# Altium schematic sheet SPI_breaktout_to_HDMI.SchDoc
size A4
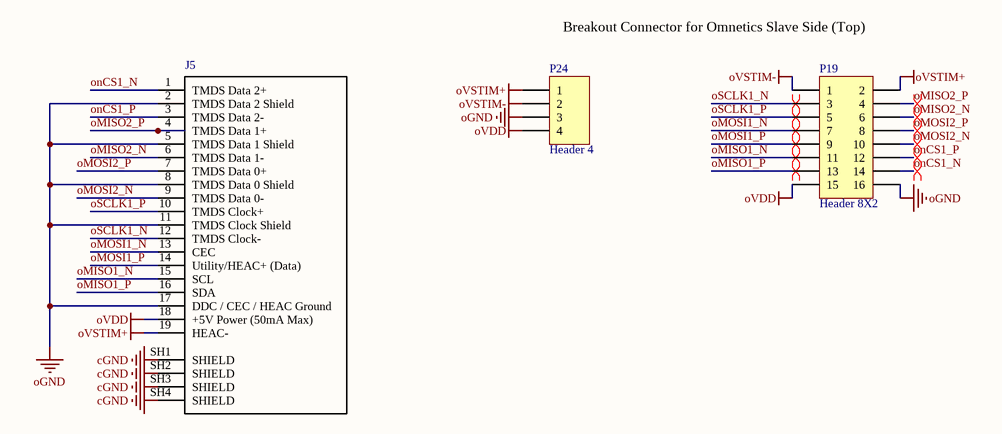
[diagram p0: SPI_breaktout_to_HDMI.SchDoc]

## Parts
J5  1747981-2  [TE_1747981-2_1747981-2(Primary)]  (value not drawn)
P19  Header 8X2  [TE_534998-8]
P24  Header 4  [OSTVN04A150]

## Nets
cGND: J5.SH1(SHIELD) J5.SH2(SHIELD) J5.SH3(SHIELD) J5.SH4(SHIELD)
oGND: J5.2(TMDS_Data_2_Shield) J5.5(TMDS_Data_1_Shield) J5.8(TMDS_Data_0_Shield) J5.11(TMDS_Clock_Shield) J5.17(DDC_/_CEC_/_HEAC_Ground) P19.16 P24.3
oVDD: J5.18(+5V_Power_(50mA_Max)) P19.15 P24.4
oVSTIM+: J5.19(HEAC-) P19.2 P24.1
oVSTIM-: P19.1 P24.2
oMISO1_N: J5.15(SCL) P19.11
oMISO1_P: J5.16(SDA) P19.13
oMISO2_N: J5.6(TMDS_Data_1-) P19.6
oMISO2_P: J5.4(TMDS_Data_1+) P19.4
oMOSI1_N: J5.13(CEC) P19.7
oMOSI1_P: J5.14(Utility/HEAC+_(Data)) P19.9
oMOSI2_N: J5.9(TMDS_Data_0-) P19.10
oMOSI2_P: J5.7(TMDS_Data_0+) P19.8
onCS1_N: J5.1(TMDS_Data_2+) P19.14
onCS1_P: J5.3(TMDS_Data_2-) P19.12
oSCLK1_N: J5.12(TMDS_Clock-) P19.3
oSCLK1_P: J5.10(TMDS_Clock+) P19.5

## Layout directives
differential pair: oMISO1_N, oMISO1_P, oMISO2_N, oMISO2_P, oMOSI1_N, oMOSI1_P, oMOSI2_N, oMOSI2_P, onCS1_N, onCS1_P, oSCLK1_N, oSCLK1_P

## Notes on the sheet
- Breakout Connector for Omnetics Slave Side (Top)

## Library data of the parts
J5 = 1747981-2: Conn HDMI RCP 19 POS 0.5mm Solder ST SMD 19 Terminal 1 Port T/R; MF: TE Connectivity; Detailed Description: HDMI Receptacle Connector 19 Position Panel Mount; Surface Mount, Right Angle; Through Hole; Pricing1: 1  6.31000  $6.31  10  6.04800  $60.48  25  5.54400  $138.60  50  5.29240  $264.62  100  5.04030  $504.03 (CAD); TE_purchase_URL: https://www.te.com/usa-en/product-1747981-2.html?te_bu=Cor&te_type=disp&te_campaign=seda_glo_cor-seda-global-disp-prtnr-fy19-seda-model-bom-cta_sma-317_1&elqCampaignId=32493; SnapEDA_Link: https://www.snapeda.com/parts/1747981-2/TE%20Connectivity%20AMP%20Connectors/view-part/?ref=snap; Package: None; MP: 1747981-2; EU_RoHS_Compliance: Compliant; Availability: Unavailable; Price: None; Value: *; ComponentLink1Description: Datasheet; ComponentLink1URL: https://www.te.com/commerce/DocumentDelivery/DDEController?Action=srchrtrv&DocNm=1747981&DocType=Customer+Drawing&DocLang=English; Manufacturer: TE Connectivity; Manufacturer Part Number: 1747981-2; Stock1: 1,426; Supplier 1: Digikey; Supplier Link 1: https://www.digikey.ca/product-detail/en/te-connectivity-amp-connectors/1747981-2/A130924CT-ND/8602669; Supplier Part Number 1: A130924CT-ND
P19 = Header 8X2: Header, 8-Pin, Dual row; Manufacturer: TE Connectivity; Manufacturer Part Number: 534998-8; Pricing1: 1  5.59000  $5.59  28  4.92321  $137.85  112  4.47580  $501.29  504  3.80446  $1,917.45  1,008  3.24498  $3,270.94 (CAD); LatestRevisionDate: 17-Jul-2002; LatestRevisionNote: Re-released for DXP Platform.; Publisher: Altium Limited; ComponentLink1Description: Datasheet; ComponentLink1URL: https://www.te.com/commerce/DocumentDelivery/DDEController?Action=srchrtrv&DocNm=534998&DocType=Customer+Drawing&DocLang=English; Stock1: 13,776; Supplier 1: Digikey; Supplier Link 1: https://www.digikey.ca/product-detail/en/te-connectivity-amp-connectors/534998-8/A26489-ND/298054; Supplier Part Number 1: A26489-ND
P24 = Header 4: Header, 4-Pin; Manufacturer: On Shore Technology Inc.; Detailed Description: 4 Position Wire to Board Terminal Block Horizontal with Board 0.100" (2.54mm) Through Hole; Pitch (Imperial): 100mil; LatestRevisionDate: 17-Jul-2002; LatestRevisionNote: Re-released for DXP Platform.; Publisher: Altium Limited; Manufacturer Part Number: OSTVN04A150; Manufacturer Link: https://www.on-shore.com/part/ostvnxxa150-terminal-block-one-piece-rising-clamp/; Supplier 1: Digikey; Supplier Link 1: https://www.digikey.com/product-detail/en/on-shore-technology-inc/OSTVN04A150/ED10563-ND/1588864; Supplier Part Number 1: ED10563-ND; Pricing 1: 1  1.38000  $1.38  10  0.96900  $9.69  25  0.90400  $22.60  50  0.82040  $41.02  100  0.81680  $81.68  250  0.68972  $172.43  500  0.65340  $326.70  1,000  0.58080  $580.80  5,000  0.47190  $2,359.50 (CAD); Stock 1: 8,195; ComponentLink1URL: http://www.on-shore.com/wp-content/uploads/OSTVNXXA150.pdf; ComponentLink1Description: Datasheet